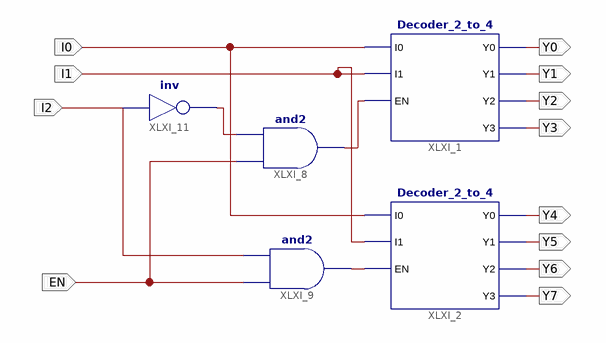
[diagram p0: schematic sheet 1]
// Xilinx ISE schematic Decoder_3_to_8.sch (spartan3e) as structural Verilog: 5 symbols, 12 ports
module Decoder_3_to_8 (
  input  EN,
  input  I0,
  input  I2,
  input  I1,
  output Y0,
  output Y1,
  output Y2,
  output Y3,
  output Y4,
  output Y5,
  output Y6,
  output Y7
);

  wire XLXN_27, XLXN_36, XLXN_39;

  Decoder_2_to_4 XLXI_1 (.EN(XLXN_36), .I0(I0), .I1(I1), .Y0(Y0), .Y1(Y1), .Y2(Y2), .Y3(Y3));
  Decoder_2_to_4 XLXI_2 (.EN(XLXN_27), .I0(I0), .I1(I1), .Y0(Y4), .Y1(Y5), .Y2(Y6), .Y3(Y7));
  and XLXI_8 (XLXN_36, EN, XLXN_39);
  and XLXI_9 (XLXN_27, EN, I2);
  not XLXI_11 (XLXN_39, I2);
endmodule
